# Altium schematic sheet adc1.SchDoc
size A4; SheetNumber: 2; SheetTotal: 2
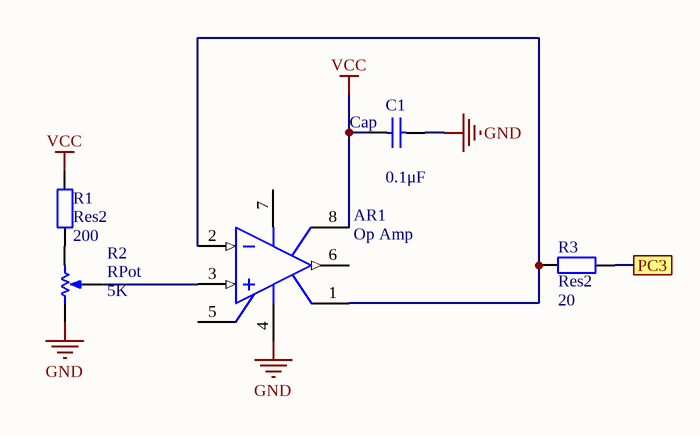
[diagram p0: adc1.SchDoc]

## Parts
AR1  Op Amp  [H-08A]
C1  Cap  value 0.1μF  [RAD-0.3]
R1  Res2  value 200  [AXIAL-0.4]
R2  RPot  value 5K  [VR5]
R3  Res2  value 20  [AXIAL-0.4]

## Ports
PC3

## Nets
GND: AR1.4(V-) C1.2 R2.1(TOP)
VCC: AR1.8(TAB) C1.1 R1.2
PC3: R3.2 ; port PC3
NetAR1_1: AR1.1(OS_NUL) AR1.2(IN-) R3.1
NetAR1_3: AR1.3(IN+) R2.3(TAP)
NetR1_1: R1.1 R2.2(BOT)

Not connected (* = marked no-connect by the designer): AR1 5(OS_NUL) 6(OUT) 7(V+)

## Library data of the parts
AR1 = Op Amp: FET Operational Amplifier; Published: 8-Jun-2000; LatestRevisionDate: 17-Jul-2002; LatestRevisionNote: Re-released for DXP Platform.; DatasheetVersion: REV. B; PackageVersion: 1990; PackageReference: H-08A; Publisher: Altium Limited; PackageDescription: Can; 8 Leads; Pin Circle Dia. 5.08 mm; Lead Dia. 0.53 mm (max); ComponentLink1Description: Manufacturer Link; ComponentLink1URL: http://www.analog.com/
C1 = Cap: Capacitor; Published: 8-Jun-2000; LatestRevisionDate: 17-Jul-2002; LatestRevisionNote: Re-released for DXP Platform.; PackageReference: RAD-0.3; Publisher: Altium Limited; PackageDescription: Radial Cap, Thru-Hole; 2 Leads; 0.3 in Pin Spacing
R1 R3 = Res2: Resistor; Published: 8-Jun-2000; LatestRevisionDate: 17-Jul-2002; LatestRevisionNote: Re-released for DXP Platform.; PackageReference: AXIAL-0.4; Publisher: Altium Limited; PackageDescription: Axial Device, Thru-Hole; 2 Leads; 0.4 in Pin Spacing
R2 = RPot: Potentiometer; Sim Note: Enter the Resistance value and the set point into parameter fields.; Set Position: 0.5; Published: 8-Jun-2000; LatestRevisionDate: 17-Jul-2002; LatestRevisionNote: Re-released for DXP Platform.; PackageReference: VR5; Publisher: Altium Limited; PackageDescription: Variable Resistor, Thru-Hole; 3 Leads